# EAGLE design Shield_2_No Ardy (EAGLE 9.2.0)
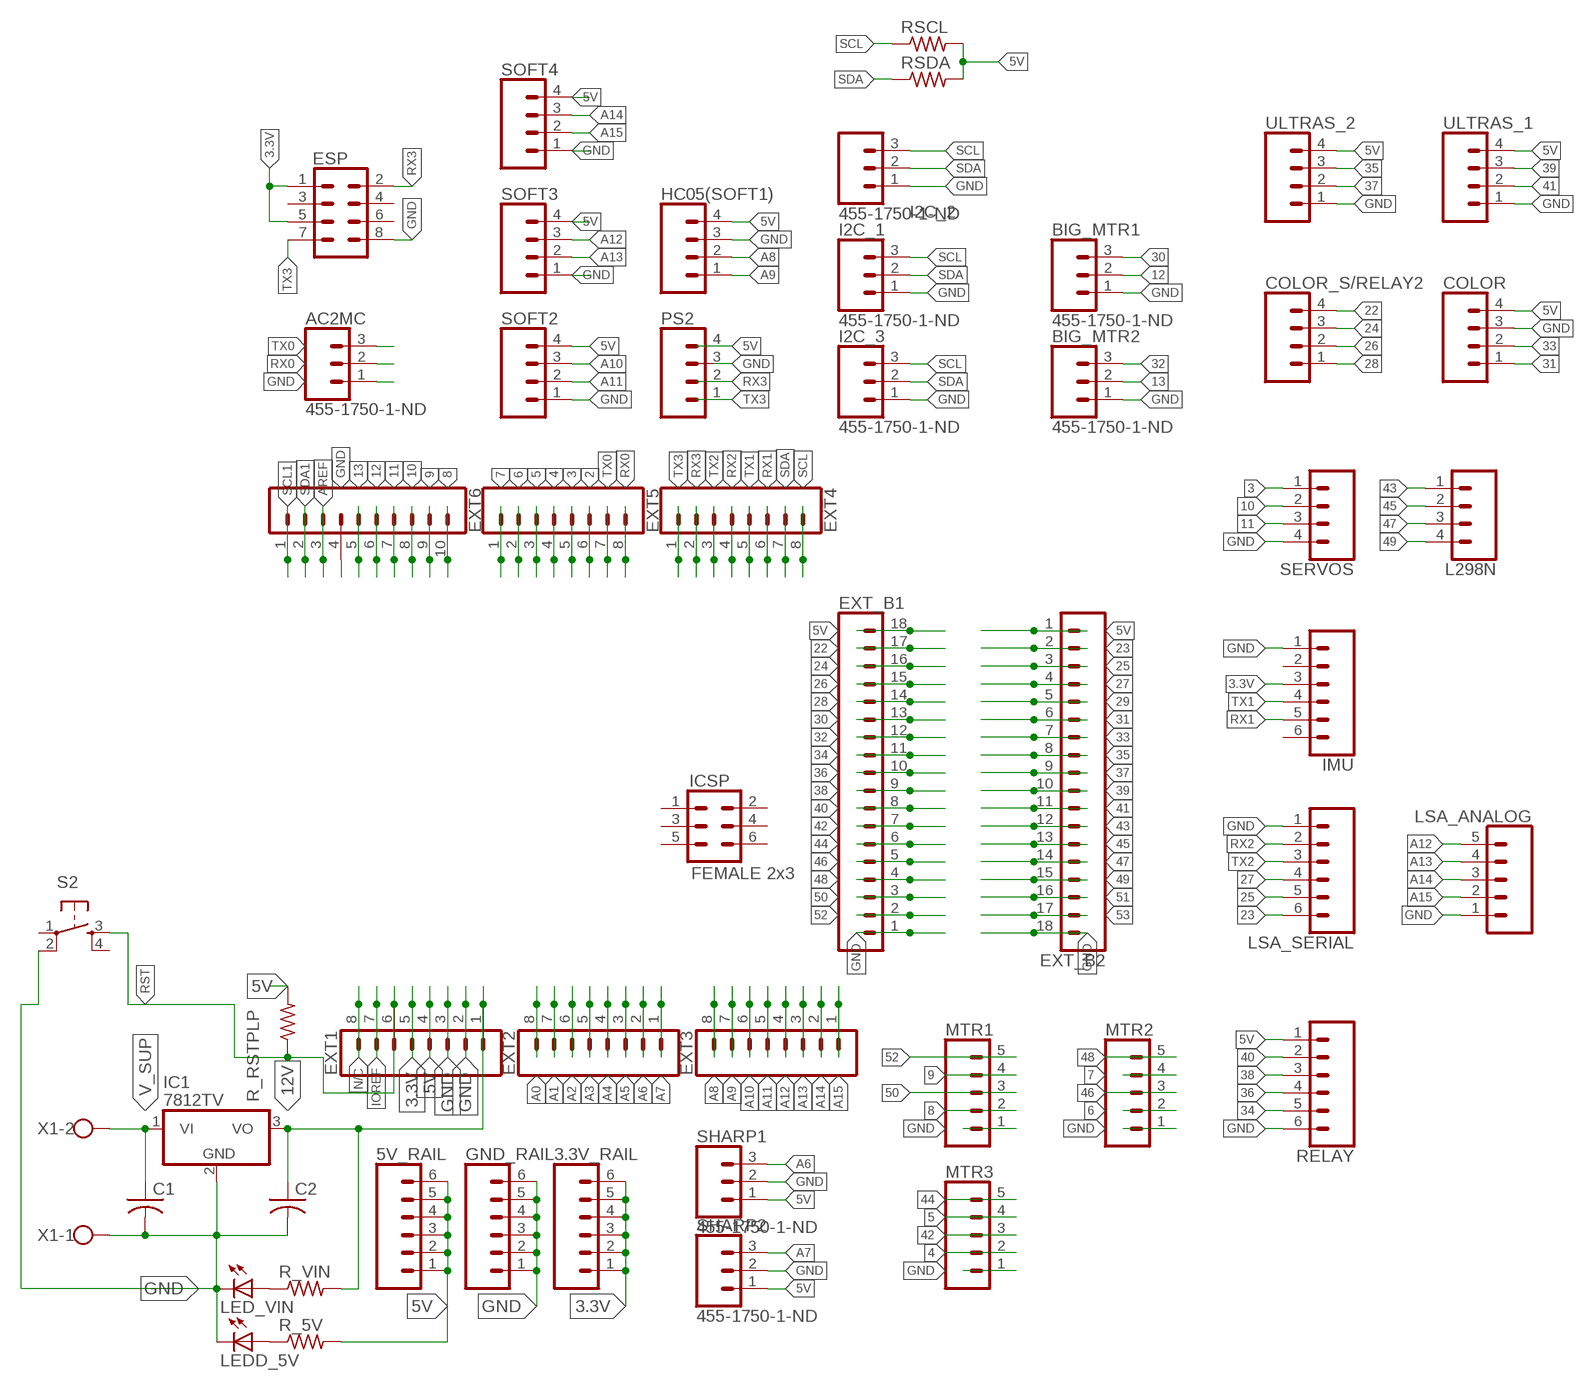
[diagram p0: schematic, sheet 1]

## Parts
3.3V_RAIL  CONN_06SILK_FEMALE_PTH  [1X06]
5V_RAIL  CONN_06SILK_FEMALE_PTH  [1X06]
AC2MC  455-1750-1-ND  CONN_03  [1X03]
BIG_MTR1  455-1750-1-ND  CONN_03  [1X03]
BIG_MTR2  455-1750-1-ND  CONN_03  [1X03]
C1  C-US025-024X044  [C025-024X044]
C2  C-US025-024X044  [C025-024X044]
COLOR  CONN_04  [1X04]
COLOR_S/RELAY2  CONN_04  [1X04]
ESP  CONN_04X2  [2X4]
EXT1  CONN_08"  [1X08]
EXT2  CONN_08"  [1X08]
EXT3  CONN_08"  [1X08]
EXT4  CONN_08"  [1X08]
EXT5  CONN_08"  [1X08]
EXT6  CONN_10"  [1X10]
EXT_B1  CONN_18  [1X18_NO_SILK]
EXT_B2  CONN_18  [1X18_NO_SILK]
GND_RAIL  CONN_06SILK_FEMALE_PTH  [1X06]
HC05(SOFT1)  CONN_04  [1X04]
I2C_1  455-1750-1-ND  CONN_03  [1X03]
I2C_2  455-1750-1-ND  CONN_03  [1X03]
I2C_3  455-1750-1-ND  CONN_03  [1X03]
IC1  7812TV  [TO220V]
ICSP  FEMALE 2x3  CONN_03X2FEMALE  [2X3]
IMU  CONN_06SILK_FEMALE_PTH  [1X06]
L298N  CONN_04  [1X04]
LED_VIN  LED5MM  [LED5MM]
LEDD_5V  LED5MM  [LED5MM]
LSA_ANALOG  CONN_05  [1X05]
LSA_SERIAL  CONN_06SILK_FEMALE_PTH  [1X06]
MTR1  CONN_05  [1X05]
MTR2  CONN_05  [1X05]
MTR3  CONN_05  [1X05]
PS2  CONN_04  [1X04]
R_5V  R-US_0204/7  [0204/7]
R_RSTPLP  R-US_0204/7  [0204/7]
R_VIN  R-US_0204/7  [0204/7]
RELAY  CONN_06SILK_FEMALE_PTH  [1X06]
RSCL  R-US_0204/7  [0204/7]
RSDA  R-US_0204/7  [0204/7]
S2  TAC_SWITCHPTH  [TACTILE-PTH]
SERVOS  CONN_04  [1X04]
SHARP1  455-1750-1-ND  CONN_03  [1X03]
SHARP2  455-1750-1-ND  CONN_03  [1X03]
SOFT2  CONN_04  [1X04]
SOFT3  CONN_04  [1X04]
SOFT4  CONN_04  [1X04]
ULTRAS_1  CONN_04  [1X04]
ULTRAS_2  CONN_04  [1X04]
X1  W237-102  [W237-102]

## Nets
2: EXT5.6
3: EXT5.5 SERVOS.1
3.3V: 3.3V_RAIL.1 3.3V_RAIL.2 3.3V_RAIL.3 3.3V_RAIL.4 3.3V_RAIL.5 3.3V_RAIL.6 ESP.1 ESP.5 EXT1.5 IMU.3
4: EXT5.4 MTR3.2
5: EXT5.3 MTR3.4
5V: 5V_RAIL.1 5V_RAIL.2 5V_RAIL.3 5V_RAIL.4 5V_RAIL.5 5V_RAIL.6 COLOR.4 EXT1.4 EXT_B1.18 EXT_B2.1 HC05(SOFT1).4 PS2.4 R_5V.2 R_RSTPLP.2 RELAY.1 RSCL.2 RSDA.2 SHARP1.1 SHARP2.1 SOFT2.4 SOFT3.4 SOFT4.4 ULTRAS_1.4 ULTRAS_2.4
6: EXT5.2 MTR2.2
7: EXT5.1 MTR2.4
8: EXT6.10 MTR1.2
9: EXT6.9 MTR1.4
10: EXT6.8 SERVOS.2
11: EXT6.7 SERVOS.3
12: BIG_MTR1.2 EXT6.6
12V: C2.1 EXT1.1 IC1.3(VO) R_VIN.2
13: BIG_MTR2.2 EXT6.5
22: COLOR_S/RELAY2.4 EXT_B1.17
23: EXT_B2.2 LSA_SERIAL.6
24: COLOR_S/RELAY2.3 EXT_B1.16
25: EXT_B2.3 LSA_SERIAL.5
26: COLOR_S/RELAY2.2 EXT_B1.15
27: EXT_B2.4 LSA_SERIAL.4
28: COLOR_S/RELAY2.1 EXT_B1.14
29: EXT_B2.5
30: BIG_MTR1.3 EXT_B1.13
31: COLOR.1 EXT_B2.6
32: BIG_MTR2.3 EXT_B1.12
33: COLOR.2 EXT_B2.7
34: EXT_B1.11 RELAY.5
35: EXT_B2.8 ULTRAS_2.3
36: EXT_B1.10 RELAY.4
37: EXT_B2.9 ULTRAS_2.2
38: EXT_B1.9 RELAY.3
39: EXT_B2.10 ULTRAS_1.3
40: EXT_B1.8 RELAY.2
41: EXT_B2.11 ULTRAS_1.2
42: EXT_B1.7 MTR3.3
43: EXT_B2.12 L298N.1
44: EXT_B1.6 MTR3.5
45: EXT_B2.13 L298N.2
46: EXT_B1.5 MTR2.3
47: EXT_B2.14 L298N.3
48: EXT_B1.4 MTR2.5
49: EXT_B2.15 L298N.4
50: EXT_B1.3 MTR1.3
51: EXT_B2.16
52: EXT_B1.2 MTR1.5
53: EXT_B2.17
A0: EXT2.8
A1: EXT2.7
A2: EXT2.6
A3: EXT2.5
A4: EXT2.4
A5: EXT2.3
A6: EXT2.2 SHARP1.3
A7: EXT2.1 SHARP2.3
A8: EXT3.8 HC05(SOFT1).2
A9: EXT3.7 HC05(SOFT1).1
A10: EXT3.6 SOFT2.3
A11: EXT3.5 SOFT2.2
A12: EXT3.4 LSA_ANALOG.5 SOFT3.3
A13: EXT3.3 LSA_ANALOG.4 SOFT3.2
A14: EXT3.2 LSA_ANALOG.3 SOFT4.3
A15: EXT3.1 LSA_ANALOG.2 SOFT4.2
AREF: EXT6.3
GND: AC2MC.1 BIG_MTR1.1 BIG_MTR2.1 C1.2 C2.2 COLOR.3 ESP.8 EXT1.2 EXT1.3 EXT6.4 EXT_B1.1 EXT_B2.18 GND_RAIL.1 GND_RAIL.2 GND_RAIL.3 GND_RAIL.4 GND_RAIL.5 GND_RAIL.6 HC05(SOFT1).3 I2C_1.1 I2C_2.1 I2C_3.1 IC1.2(GND) IMU.1 LED_VIN.K(C) LEDD_5V.K(C) LSA_ANALOG.1 LSA_SERIAL.1 MTR1.1 MTR2.1 MTR3.1 PS2.3 RELAY.6 S2.2 SERVOS.4 SHARP1.2 SHARP2.2 SOFT2.1 SOFT3.1 SOFT4.1 ULTRAS_1.1 ULTRAS_2.1 X1.1
IOREF: EXT1.7
N$4: LED_VIN.A R_VIN.1
N$5: LEDD_5V.A R_5V.1
N/C: EXT1.8
RST: EXT1.6 R_RSTPLP.1 S2.3
RX0: AC2MC.2 EXT5.8
RX1: EXT4.6 IMU.5
RX2: EXT4.4 LSA_SERIAL.2
RX3: ESP.2 EXT4.2 PS2.2
SCL: EXT4.8 I2C_1.3 I2C_2.3 I2C_3.3 RSCL.1
SCL1: EXT6.1
SDA: EXT4.7 I2C_1.2 I2C_2.2 I2C_3.2 RSDA.1
SDA1: EXT6.2
TX0: AC2MC.3 EXT5.7
TX1: EXT4.5 IMU.4
TX2: EXT4.3 LSA_SERIAL.3
TX3: ESP.7 EXT4.1 PS2.1
V_SUP: C1.1 IC1.1(VI) X1.2
Unconnected: ESP.3 ESP.4 ESP.6 ICSP.1 ICSP.2 ICSP.3 ICSP.4 ICSP.5 ICSP.6 IMU.2 IMU.6 S2.1 S2.4

## Library data of the parts
3.3V_RAIL 5V_RAIL GND_RAIL IMU LSA_SERIAL RELAY = SparkFun-Connectors:CONN_06: Multi connection point. Often used as Generic Header-pin footprint for 0.1 inch spaced/style header connections On any of the 0.1 inch spaced packages, you can populate with these: Break Away Headers - Straight <https://www.sparkfun.com/products/116> (PRT-00116) Break Away Male Headers - Right Angle <https://www.sparkfun.com/products/553> (PRT-00553) Female Headers <https://www.sparkfun.com/products/115> (PRT-00115) Break Away Headers - Machine Pin <https://www.sparkfun.com/products/117> (PRT-00117) Break Away Female Headers - Swiss Machine Pin <https://www.sparkfun.com/products/743> (PRT-00743) Arduino Stackable Header - 6 Pin <https://www.sparkfun.com/products/9280> (PRT-09280) For SCREWTERMINALS and SPRING TERMINALS visit here: Screw Terimnals on SparkFun.com <https://www.sparkfun.com/search/results?term=Screw+Terminals> (5mm/3.5mm/2.54mm spacing) This device is also useful as a general connection point to wire up your design to another part of your project. Our various solder wires solder well into these plated through hole pads. Hook-Up Wire - Assortment (Stranded, 22 AWG) <https://www.sparkfun.com/products/11375> (PRT-11375) Hook-Up Wire - Assortment (Solid Core, 22 AWG) <https://www.sparkfun.com/products/11367> (PRT-11367) View the entire wire category on our website here <https://www.sparkfun.com/categories/141>; PROD_ID: CONN-08437
AC2MC BIG_MTR1 BIG_MTR2 I2C_1-I2C_3 SHARP1 SHARP2 = SparkFun-Connectors:CONN_03: Multi connection point. Often used as Generic Header-pin footprint for 0.1 inch spaced/style header connections On any of the 0.1 inch spaced packages, you can populate with these: Break Away Headers - Straight <https://www.sparkfun.com/products/116> (PRT-00116) Break Away Male Headers - Right Angle <https://www.sparkfun.com/products/553> (PRT-00553) Female Headers <https://www.sparkfun.com/products/115> (PRT-00115) Break Away Headers - Machine Pin <https://www.sparkfun.com/products/117> (PRT-00117) Break Away Female Headers - Swiss Machine Pin <https://www.sparkfun.com/products/743> (PRT-00743) Stackable Header - 3 Pin (Female, 0.1") <https://www.sparkfun.com/products/13875> (PRT-13875) For SCREWTERMINALS and SPRING TERMINALS visit here: Screw Terimnals on SparkFun.com <https://www.sparkfun.com/search/results?term=Screw+Terminals> (5mm/3.5mm/2.54mm spacing) This device is also useful as a general connection point to wire up your design to another part of your project. Our various solder wires solder well into these plated through hole pads. Hook-Up Wire - Assortment (Stranded, 22 AWG) <https://www.sparkfun.com/products/11375> (PRT-11375) Hook-Up Wire - Assortment (Solid Core, 22 AWG) <https://www.sparkfun.com/products/11367> (PRT-11367) View the entire wire category on our website here <https://www.sparkfun.com/categories/141> Special notes: Molex polarized connector foot print use with SKU : PRT-08232 with associated crimp pins and housings.; PROD_ID: XXX-00000
C1 C2 = adafruit:C-US: CAPACITOR, American symbol
COLOR COLOR_S/RELAY2 HC05(SOFT1) L298N PS2 SERVOS SOFT2-SOFT4 ULTRAS_1 ULTRAS_2 = SparkFun-Connectors:CONN_04: Multi connection point. Often used as Generic Header-pin footprint for 0.1 inch spaced/style header connections On any of the 0.1 inch spaced packages, you can populate with these: Break Away Headers - Straight <https://www.sparkfun.com/products/116> (PRT-00116) Break Away Male Headers - Right Angle <https://www.sparkfun.com/products/553> (PRT-00553) Female Headers <https://www.sparkfun.com/products/115> (PRT-00115) Break Away Headers - Machine Pin <https://www.sparkfun.com/products/117> (PRT-00117) Break Away Female Headers - Swiss Machine Pin <https://www.sparkfun.com/products/743> (PRT-00743) For SCREWTERMINALS and SPRING TERMINALS visit here: Screw Terimnals on SparkFun.com <https://www.sparkfun.com/search/results?term=Screw+Terminals> (5mm/3.5mm/2.54mm spacing) This device is also useful as a general connection point to wire up your design to another part of your project. Our various solder wires solder well into these plated through hole pads. Hook-Up Wire - Assortment (Stranded, 22 AWG) <https://www.sparkfun.com/products/11375> (PRT-11375) Hook-Up Wire - Assortment (Solid Core, 22 AWG) <https://www.sparkfun.com/products/11367> (PRT-11367) View the entire wire category on our website here <https://www.sparkfun.com/categories/141> Special notes: Molex polarized connector foot print use with SKU : PRT-08231 with associated crimp pins and housings. 1MM SMD Version SKU: PRT-10208; PROD_ID: CONN-09696
ESP = SparkFun-Connectors:CONN_04X2: Multi connection point. Often used as Generic Header-pin footprint for 0.1 inch spaced/style header connections On any of the 0.1 inch spaced packages, you can populate with these: Break Away Headers - Straight <https://www.sparkfun.com/products/116> (PRT-00116) Break Away Male Headers - Right Angle <https://www.sparkfun.com/products/553> (PRT-00553) Female Headers <https://www.sparkfun.com/products/115> (PRT-00115) Break Away Headers - Machine Pin <https://www.sparkfun.com/products/117> (PRT-00117) Break Away Female Headers - Swiss Machine Pin <https://www.sparkfun.com/products/743> (PRT-00743)
EXT1-EXT5 = SparkFun-Connectors:CONN_08: Multi connection point. Often used as Generic Header-pin footprint for 0.1 inch spaced/style header connections On any of the 0.1 inch spaced packages, you can populate with these: Break Away Headers - Straight <https://www.sparkfun.com/products/116> (PRT-00116) Break Away Male Headers - Right Angle <https://www.sparkfun.com/products/553> (PRT-00553) Female Headers <https://www.sparkfun.com/products/115> (PRT-00115) Break Away Headers - Machine Pin <https://www.sparkfun.com/products/117> (PRT-00117) Break Away Female Headers - Swiss Machine Pin <https://www.sparkfun.com/products/743> (PRT-00743) Arduino Stackable Header - 8 Pin <https://www.sparkfun.com/products/9279> (PRT-09279) For SCREWTERMINALS and SPRING TERMINALS visit here: Screw Terimnals on SparkFun.com <https://www.sparkfun.com/search/results?term=Screw+Terminals> (5mm/3.5mm/2.54mm spacing) This device is also useful as a general connection point to wire up your design to another part of your project. Our various solder wires solder well into these plated through hole pads. Hook-Up Wire - Assortment (Stranded, 22 AWG) <https://www.sparkfun.com/products/11375> (PRT-11375) Hook-Up Wire - Assortment (Solid Core, 22 AWG) <https://www.sparkfun.com/products/11367> (PRT-11367) View the entire wire category on our website here <https://www.sparkfun.com/categories/141> Special notes: Molex polarized connector foot print use with SKU : PRT-08231 with associated crimp pins and housings. 1MM SMD Version SKU: PRT-10208 NOTES ON THE VARIANTS LOCK and LOCK_LONGPADS... This footprint was designed to help hold the alignment of a through-hole component (i.e. 6-pin header) while soldering it into place. You may notice that each hole has been shifted either up or down by 0.005 of an inch from it's more standard position (which is a perfectly straight line). This slight alteration caused the pins (the squares in the middle) to touch the edges of the holes. Because they are alternating, it causes a "brace" to hold the component in place. 0.005 has proven to be the perfect amount of "off-center" position when using our standard breakaway headers. Although looks a little odd when you look at the bare footprint, once you have a header in there, the alteration is very hard to notice. Also,if you push a header all the way into place, it is covered up entirely on the bottom side.; PROD_ID: CONN-08438
EXT6 = SparkFun-Connectors:CONN_10: Multi connection point. Often used as Generic Header-pin footprint for 0.1 inch spaced/style header connections On any of the 0.1 inch spaced packages, you can populate with these: Break Away Headers - Straight <https://www.sparkfun.com/products/116> (PRT-00116) Break Away Male Headers - Right Angle <https://www.sparkfun.com/products/553> (PRT-00553) Female Headers <https://www.sparkfun.com/products/115> (PRT-00115) Break Away Headers - Machine Pin <https://www.sparkfun.com/products/117> (PRT-00117) Break Away Female Headers - Swiss Machine Pin <https://www.sparkfun.com/products/743> (PRT-00743) Arduino Stackable Header - 10 Pin <https://www.sparkfun.com/products/11376> (PRT-11376) For SCREWTERMINALS and SPRING TERMINALS visit here: Screw Terimnals on SparkFun.com <https://www.sparkfun.com/search/results?term=Screw+Terminals> (5mm/3.5mm/2.54mm spacing) This device is also useful as a general connection point to wire up your design to another part of your project. Our various solder wires solder well into these plated through hole pads. Hook-Up Wire - Assortment (Stranded, 22 AWG) <https://www.sparkfun.com/products/11375> (PRT-11375) Hook-Up Wire - Assortment (Solid Core, 22 AWG) <https://www.sparkfun.com/products/11367> (PRT-11367) View the entire wire category on our website here <https://www.sparkfun.com/categories/141> Special notes: Molex polarized connector foot print use with SKU : PRT-08231 with associated crimp pins and housings. 1MM SMD Version SKU: PRT-10208 NOTES ON THE VARIANTS LOCK and LOCK_LONGPADS... This footprint was designed to help hold the alignment of a through-hole component (i.e. 6-pin header) while soldering it into place. You may notice that each hole has been shifted either up or down by 0.005 of an inch from it's more standard position (which is a perfectly straight line). This slight alteration caused the pins (the squares in the middle) to touch the edges of the holes. Because they are alternating, it causes a "brace" to hold the component in place. 0.005 has proven to be the perfect amount of "off-center" position when using our standard breakaway headers. Although looks a little odd when you look at the bare footprint, once you have a header in there, the alteration is very hard to notice. Also,if you push a header all the way into place, it is covered up entirely on the bottom side.; PROD_ID: CONN-11563
EXT_B1 EXT_B2 = SparkFun-Connectors:CONN_18: Multi connection point. Often used as Generic Header-pin footprint for 0.1 inch spaced/style header connections On any of the 0.1 inch spaced packages, you can populate with these: Break Away Headers - Straight <https://www.sparkfun.com/products/116> (PRT-00116) Break Away Male Headers - Right Angle <https://www.sparkfun.com/products/553> (PRT-00553) Female Headers <https://www.sparkfun.com/products/115> (PRT-00115) Break Away Headers - Machine Pin <https://www.sparkfun.com/products/117> (PRT-00117) Break Away Female Headers - Swiss Machine Pin <https://www.sparkfun.com/products/743> (PRT-00743) For SCREWTERMINALS and SPRING TERMINALS visit here: Screw Terimnals on SparkFun.com <https://www.sparkfun.com/search/results?term=Screw+Terminals> (5mm/3.5mm/2.54mm spacing) This device is also useful as a general connection point to wire up your design to another part of your project. Our various solder wires solder well into these plated through hole pads. Hook-Up Wire - Assortment (Stranded, 22 AWG) <https://www.sparkfun.com/products/11375> (PRT-11375) Hook-Up Wire - Assortment (Solid Core, 22 AWG) <https://www.sparkfun.com/products/11367> (PRT-11367) View the entire wire category on our website here <https://www.sparkfun.com/categories/141> Special notes: Molex polarized connector foot print use with SKU : PRT-08231 with associated crimp pins and housings. 1MM SMD Version SKU: PRT-10208 NOTES ON THE VARIANTS LOCK and LOCK_LONGPADS... This footprint was designed to help hold the alignment of a through-hole component (i.e. 6-pin header) while soldering it into place. You may notice that each hole has been shifted either up or down by 0.005 of an inch from it's more standard position (which is a perfectly straight line). This slight alteration caused the pins (the squares in the middle) to touch the edges of the holes. Because they are alternating, it causes a "brace" to hold the component in place. 0.005 has proven to be the perfect amount of "off-center" position when using our standard breakaway headers. Although looks a little odd when you look at the bare footprint, once you have a header in there, the alteration is very hard to notice. Also,if you push a header all the way into place, it is covered up entirely on the bottom side.
IC1 = linear:78*: Positive VOLTAGE REGULATOR Source: http://cache.national.com/ds/LM/LM78L05.pdf http://www.fairchildsemi.com/ds/LM/LM7805.pdf
ICSP = SparkFun-Connectors:CONN_03X2: Multi connection point. Often used as Generic Header-pin footprint for 0.1 inch spaced/style header connections You can populate with any combo of single row headers, but if you'd like an exact match, check these: Header - 2x3 (Male, 0.1") <https://www.sparkfun.com/products/12807> (PRT-12807) Header - 2x3 (Female, 0.1") <https://www.sparkfun.com/products/13010> (PRT-13010) 2x3 Pin Shrouded Header <https://www.sparkfun.com/products/10877> (PRT-10877) On any of the 0.1 inch spaced packages, you can populate with these: Break Away Headers - Straight <https://www.sparkfun.com/products/116> (PRT-00116) Break Away Male Headers - Right Angle <https://www.sparkfun.com/products/553> (PRT-00553) Female Headers <https://www.sparkfun.com/products/115> (PRT-00115) Break Away Headers - Machine Pin <https://www.sparkfun.com/products/117> (PRT-00117) Break Away Female Headers - Swiss Machine Pin <https://www.sparkfun.com/products/743> (PRT-00743) Special note: the shrouded connector mates well with our 3x2 ribbon cables: Ribbon Crimp Connector - 6-pin (2x3, Female) <https://www.sparkfun.com/products/10651> (PRT-10651) Ribbon Cable - 6 wire (15ft) <https://www.sparkfun.com/products/10646> (PRT-10646); PROD_ID: CONN-11566
LED_VIN LEDD_5V = adafruit:LED: LED OSRAM: - CHIPLED LG R971, LG N971, LY N971, LG Q971, LY Q971, LO R971, LY R971 LH N974, LH R974 LS Q976, LO Q976, LY Q976 LO Q996 - Hyper CHIPLED LW Q18S LB Q993, LB Q99A, LB R99A - SideLED LS A670, LO A670, LY A670, LG A670, LP A670 LB A673, LV A673, LT A673, LW A673 LH A674 LY A675 LS A676, LA A676, LO A676, LY A676, LW A676 LS A679, LY A679, LG A679 - Hyper Micro SIDELED® LS Y876, LA Y876, LO Y876, LY Y876 LT Y87S - SmartLED LW L88C, LW L88S LB L89C, LB L89S, LG L890 LS L89K, LO L89K, LY L89K LS L896, LA L896, LO L896, LY L896 - TOPLED LS T670, LO T670, LY T670, LG T670, LP T670 LSG T670, LSP T670, LSY T670, LOP T670, LYG T670 LG T671, LOG T671, LSG T671 LB T673, LV T673, LT T673, LW T673 LH T674 LS T676, LA T676, LO T676, LY T676, LB T676, LH T676, LSB T676, LW T676 LB T67C, LV T67C, LT T67C, LS T67K, LO T67K, LY T67K, LW E67C LS E67B, LA E67B, LO E67B, LY E67B, LB E67C, LV E67C, LT E67C LW T67C LS T679, LY T679, LG T679 LS T770, LO T770, LY T770, LG T770, LP T770 LB T773, LV T773, LT T773, LW T773 LH T774 LS E675, LA E675, LY E675, LS T675 LS T776, LA T776, LO T776, LY T776, LB T776 LHGB T686 LT T68C, LB T68C - Hyper Mini TOPLED® LB M676 - Mini TOPLED Santana® LG M470 LS M47K, LO M47K, LY M47K Source: http://www.osram.convergy.de/
LSA_ANALOG MTR1-MTR3 = SparkFun-Connectors:CONN_05: Multi connection point. Often used as Generic Header-pin footprint for 0.1 inch spaced/style header connections On any of the 0.1 inch spaced packages, you can populate with these: Break Away Headers - Straight <https://www.sparkfun.com/products/116> (PRT-00116) Break Away Male Headers - Right Angle <https://www.sparkfun.com/products/553> (PRT-00553) Female Headers <https://www.sparkfun.com/products/115> (PRT-00115) Break Away Headers - Machine Pin <https://www.sparkfun.com/products/117> (PRT-00117) Break Away Female Headers - Swiss Machine Pin <https://www.sparkfun.com/products/743> (PRT-00743) For SCREWTERMINALS and SPRING TERMINALS visit here: Screw Terimnals on SparkFun.com <https://www.sparkfun.com/search/results?term=Screw+Terminals> (5mm/3.5mm/2.54mm spacing) This device is also useful as a general connection point to wire up your design to another part of your project. Our various solder wires solder well into these plated through hole pads. Hook-Up Wire - Assortment (Stranded, 22 AWG) <https://www.sparkfun.com/products/11375> (PRT-11375) Hook-Up Wire - Assortment (Solid Core, 22 AWG) <https://www.sparkfun.com/products/11367> (PRT-11367) View the entire wire category on our website here <https://www.sparkfun.com/categories/141> Special notes: Molex polarized connector foot print use with SKU : PRT-08231 with associated crimp pins and housings. 1MM SMD Version SKU: PRT-10208
R_5V R_RSTPLP R_VIN RSCL RSDA = adafruit:R-US_: RESISTOR, American symbol
S2 = SparkFun-Retired:TAC_SWITCH: Momentary Switch Button commonly used for reset or general input. Spark Fun Electronics SKU : COM-00097 SMT- SWCH-08247
X1 = con-wago-500:W237-102: WAGO SCREW CLAMP; MPN: 237-102; OC_FARNELL: unknown; OC_NEWARK: 70K9898

## Board
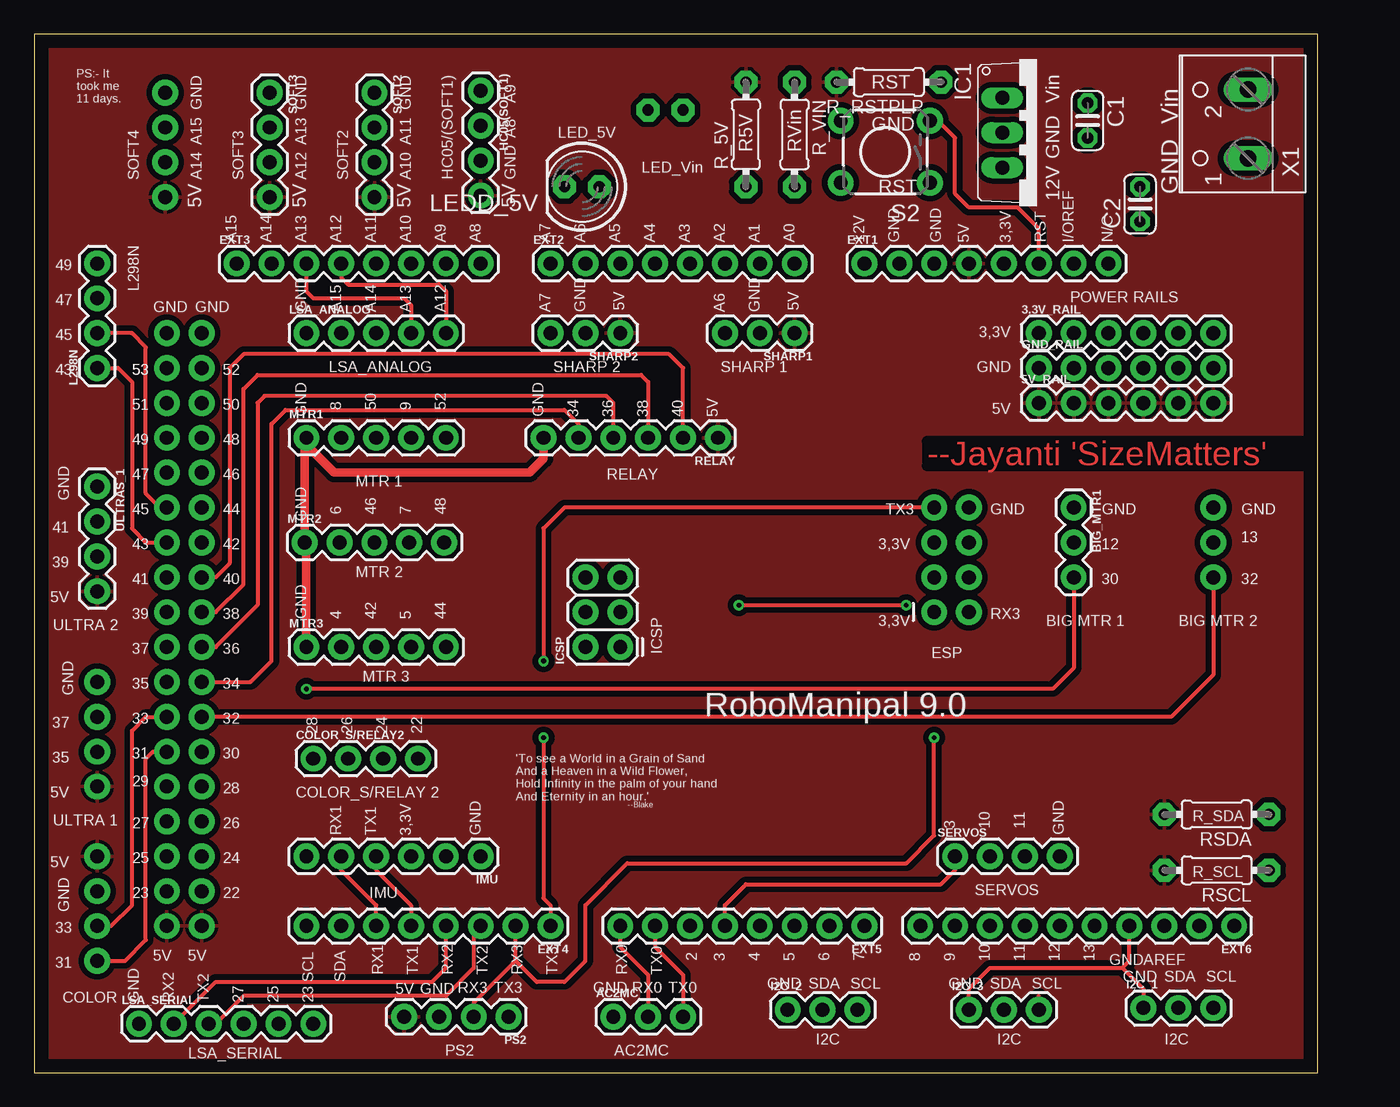
[diagram p1: board, top side]
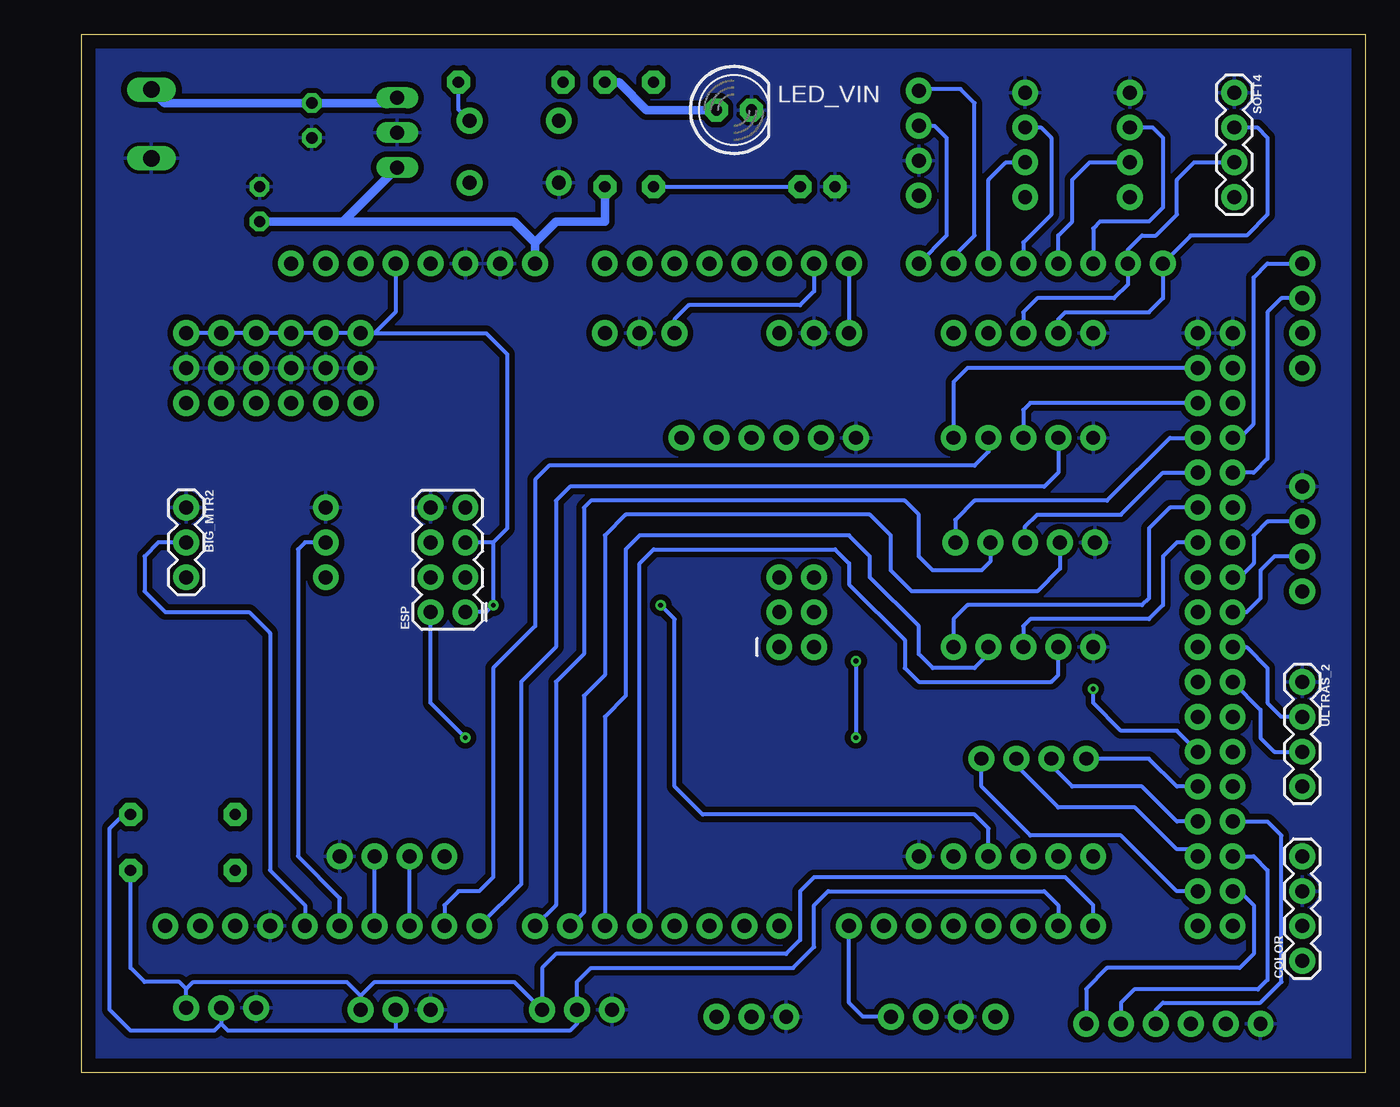
[diagram p2: board, bottom side, seen from below]

Size 93.45 x 75.62 mm. Coordinates in mm from the lower left corner, seen from the top.
Outline: 0,0 93.45,0 93.45,75.62 0,75.62 0,0
Copper layers (1*16): Top 0.035mm / dielectric 1.5mm / Bottom 0.035mm
Design rules "default": minimum track width 6mil, minimum drill 0.35mm, track to track 6mil, track to pad 6mil, pad to pad 6mil, via to via 6mil, smd to smd 6mil, copper to edge 40mil, drill to drill 6mil, minimum pad ring 10mil, minimum via ring 8mil, stop-mask expansion 4mil, vias tented up to drill 0mil, thermal gap 10mil

### Footprints (pad centres in the part's own frame; a part is rotated, then mirrored left to right if it is on the bottom)
1X06 = drill 1.016 pad 1.88: 1 0,0; 2 2.54,0; 3 5.08,0; 4 7.62,0; 5 10.16,0; 6 12.7,0
1X03 = drill 1.016 pad 1.88: 1 0,0; 2 2.54,0; 3 5.08,0
C025-024X044 = drill 0.813 pad 1.422 octagon: 1 -1.27,0; 2 1.27,0
1X04 = drill 1.016 pad 1.88: 1 0,0; 2 2.54,0; 3 5.08,0; 4 7.62,0
2X4 = drill 1.016 pad 1.88: 1 -3.81,-1.27; 2 -3.81,1.27; 3 -1.27,-1.27; 4 -1.27,1.27; 5 1.27,-1.27; 6 1.27,1.27; 7 3.81,-1.27; 8 3.81,1.27
1X08 = drill 1.016 pad 1.88: 1 0,0; 2 2.54,0; 3 5.08,0; 4 7.62,0; 5 10.16,0; 6 12.7,0; 7 15.24,0; 8 17.78,0
1X10 = drill 1.016 pad 1.88: 1 0,0; 2 2.54,0; 3 5.08,0; 4 7.62,0; 5 10.16,0; 6 12.7,0; 7 15.24,0; 8 17.78,0; 9 20.32,0; 10 22.86,0
1X18_NO_SILK = drill 1.016 pad 1.88: 1 0,0; 2 2.54,0; 3 5.08,0; 4 7.62,0; 5 10.16,0; 6 12.7,0; 7 15.24,0; 8 17.78,0; 9 20.32,0; 10 22.86,0; 11 25.4,0; 12 27.94,0; 13 30.48,0; 14 33.02,0; 15 35.56,0; 16 38.1,0; 17 40.64,0; 18 43.18,0
TO220V = drill 1.016 long: 1 -2.54,-2.54; 2 0,-2.54; 3 2.54,-2.54
2X3 = drill 1.016 pad 1.88: 1 0,0; 2 0,2.54; 3 2.54,0; 4 2.54,2.54; 5 5.08,0; 6 5.08,2.54
LED5MM = drill 0.813 pad 1.676 octagon: A -1.27,0; K 1.27,0
1X05 = drill 1.016 pad 1.88: 1 0,0; 2 2.54,0; 3 5.08,0; 4 7.62,0; 5 10.16,0
0204/7 = drill 0.813 pad 1.676 octagon: 1 -3.81,0; 2 3.81,0
TACTILE-PTH = drill 1.016 pad 1.88: 1 -3.251,2.261; 2 3.251,2.261; 3 -3.251,-2.261; 4 3.251,-2.261
W237-102 = drill 1.194 long: 1 -2.5,-1.27; 2 2.5,-1.27

### Placement (x,y rotation side)
3.3V_RAIL  73.15,53.85 0 top
5V_RAIL  73.15,48.77 0 top
AC2MC  42.16,4.06 0 top
BIG_MTR1  75.69,41.15 270 top
BIG_MTR2  85.85,41.15 270 bottom
C1  76.71,69.34 270 top
C2  80.52,63.25 90 top
COLOR  4.57,8.13 90 bottom
COLOR_S/RELAY2  20.32,22.86 0 top
ESP  66.8,37.34 90 bottom
EXT1  60.45,58.93 0 top
EXT2  37.59,58.93 0 top
EXT3  14.73,58.93 0 top
EXT4  37.59,10.67 180 top
EXT5  60.45,10.67 180 top
EXT6  87.38,10.67 180 top
EXT_B1  12.19,53.85 270 bottom
EXT_B2  9.65,10.67 90 top
GND_RAIL  73.15,51.31 0 top
HC05(SOFT1)  32.51,71.5 270 top
I2C_1  80.77,4.7 0 top
I2C_2  54.86,4.57 0 top
I2C_3  68.07,4.57 0 top
IC1  73.03,68.45 270 top
ICSP  42.67,30.99 90 top
IMU  32.51,15.75 180 top
L298N  4.57,51.31 90 top
LED_VIN  45.97,70.1 0 bottom
LEDD_5V  39.88,64.52 180 top
LSA_ANALOG  19.81,53.85 0 top
LSA_SERIAL  7.62,3.56 0 top
MTR1  19.81,46.23 0 top
MTR2  19.69,38.61 0 top
MTR3  19.81,30.99 0 top
PS2  34.54,4.06 180 top
R_5V  51.82,68.33 90 top
R_RSTPLP  62.23,72.14 180 top
R_VIN  55.37,68.33 270 top
RELAY  49.78,46.23 180 top
RSCL  86.11,14.73 180 top
RSDA  86.11,18.8 180 top
S2  61.98,67.06 180 top
SERVOS  67.06,15.75 0 top
SHARP1  55.37,53.85 180 top
SHARP2  42.67,53.85 180 top
SOFT2  24.77,71.37 270 top
SOFT3  17.14,71.37 270 top
SOFT4  9.52,71.37 270 bottom
ULTRAS_1  4.57,42.67 270 top
ULTRAS_2  4.57,28.45 270 bottom
X1  87.12,69.09 90 top

### Tracks (layer width: path | path; a pad name or v marks a point on that pad's centre or on a via)
3
  Top 0.305: EXT5.5 50.29,12.19 51.82,13.72 66.04,13.72 67.06,14.73 SERVOS.1
3.3V  (via drill 0.35)
  Top 0.305: v51.31,34.04 v63.5,34.04
  Bottom 0.305: 3.3V_RAIL.1 3.3V_RAIL.2 3.3V_RAIL.3 3.3V_RAIL.4 3.3V_RAIL.5 3.3V_RAIL.6 | EXT1.5 70.61,55.37 72.14,53.85 3.3V_RAIL.1 | 3.3V_RAIL.1 64.01,53.85 62.48,52.32 62.48,39.62 63.5,38.61 | 63.5,38.61 ESP.5 | 63.5,38.61 v63.5,34.04 64.01,33.53 ESP.1 | IMU.3 27.43,17.78 28.45,18.8 48.26,18.8 50.29,20.83 50.29,33.02 v51.31,34.04
4
  Bottom 0.305: EXT5.4 52.83,37.08 51.82,38.1 38.61,38.1 37.59,37.08 37.59,35.56 33.53,31.5 33.53,29.46 32.51,28.45 22.86,28.45 22.35,28.96 MTR3.2
5
  Bottom 0.305: MTR3.4 27.43,30.48 28.45,29.46 31.5,29.46 32.51,30.48 32.51,32.51 36.07,36.07 36.07,37.59 37.59,39.12 52.83,39.12 53.85,38.1 53.85,27.43 55.37,25.91 EXT5.3
5V
  pour Top (isolate 0.406): -3.05,79.25 96.01,79.25 96.01,-2.03 -3.05,-2.03
6
  Bottom 0.305: MTR2.2 22.23,36.7 23.88,35.05 33.02,35.05 34.54,36.58 34.54,39.12 36.07,40.64 53.85,40.64 55.37,39.12 55.37,28.96 56.9,27.43 56.9,11.68 EXT5.2
7
  Bottom 0.305: MTR2.4 27.3,37.21 27.94,36.58 31.5,36.58 32.51,37.59 32.51,40.64 33.53,41.66 56.39,41.66 56.9,41.15 56.9,30.48 58.93,28.45 58.93,12.19 EXT5.1
8
  Bottom 0.305: MTR1.2 22.35,43.69 23.37,42.67 57.91,42.67 58.93,41.66 58.93,30.99 61.47,28.45 61.47,13.72 EXT6.10
9
  Bottom 0.305: MTR1.4 27.43,45.21 28.45,44.2 59.44,44.2 60.45,43.18 60.45,32.51 63.5,29.46 63.5,14.22 64.52,13.21 66.04,13.21 67.06,12.19 EXT6.9
10
  Bottom 0.305: EXT6.8 SERVOS.2
11
  Bottom 0.305: EXT6.7 SERVOS.3
12
  Bottom 0.305: EXT6.6 74.68,12.7 77.72,15.75 77.72,38.1 77.22,38.61 BIG_MTR1.2
12V
  Bottom 0.61: 70.48,65.66 IC1.3 74.42,61.98 | EXT1.1 60.45,60.45 | 60.45,60.45 61.98,61.98 74.42,61.98 | 60.45,60.45 58.93,61.98 55.37,61.98 R_VIN.2 | 74.42,61.98 C2.1
13
  Bottom 0.305: BIG_MTR2.2 87.88,38.61 88.9,37.59 88.9,35.05 87.38,33.53 81.28,33.53 79.76,32 79.76,14.73 77.22,12.19 EXT6.5
22
  Bottom 0.305: EXT_B1.17 13.72,13.21 17.78,17.27 24.38,17.27 27.94,20.83 COLOR_S/RELAY2.4
23
  Bottom 0.305: EXT_B2.2 9.14,13.21 8.13,12.19 8.13,8.64 9.14,7.62 18.8,7.62 20.32,6.1 LSA_SERIAL.6
24
  Bottom 0.305: COLOR_S/RELAY2.3 25.4,22.35 22.35,19.3 16.76,19.3 13.72,16.26 12.7,16.26 EXT_B1.16
25
  Bottom 0.305: EXT_B2.3 8.13,15.75 7.11,14.73 7.11,6.74 7.81,6.04 16.82,6.04 17.78,5.08 LSA_SERIAL.5
26
  Bottom 0.305: EXT_B1.15 13.72,18.29 16.26,20.83 21.34,20.83 22.86,22.35 COLOR_S/RELAY2.2
27
  Bottom 0.305: EXT_B2.4 7.11,18.29 6.1,17.27 6.1,6.6 7.62,5.08 14.73,5.08 15.24,4.57 LSA_SERIAL.4
28
  Bottom 0.305: EXT_B1.14 13.72,20.83 15.75,22.86 COLOR_S/RELAY2.1
30  (via drill 0.35)
  Top 0.305: BIG_MTR1.3 75.69,29.46 74.17,27.94 v19.81,27.94
  Bottom 0.305: EXT_B1.13 13.72,24.89 17.78,24.89 19.81,26.92 v19.81,27.94
31
  Top 0.305: COLOR.1 6.6,8.13 8.13,9.65 8.13,22.86 8.64,23.37 EXT_B2.6
32
  Top 0.305: BIG_MTR2.3 85.85,28.96 82.8,25.91 EXT_B1.12 11.68,25.91
33
  Top 0.305: COLOR.2 5.59,10.67 7.11,12.19 7.11,24.89 8.13,25.91 EXT_B2.7
34
  Top 0.305: RELAY.5 39.62,47.24 38.61,48.26 18.29,48.26 17.27,47.24 17.27,29.97 15.75,28.45 EXT_B1.11
35
  Bottom 0.305: EXT_B2.8 7.62,26.42 7.62,24.38 6.6,23.37 ULTRAS_2.3
36
  Top 0.305: RELAY.4 42.16,48.77 41.66,49.28 16.76,49.28 16.26,48.77 16.26,34.04 13.21,30.99 EXT_B1.10
37
  Bottom 0.305: ULTRAS_2.2 6.1,25.91 7.11,26.92 7.11,29.46 8.64,30.99 EXT_B2.9
38
  Top 0.305: RELAY.3 44.7,50.29 44.2,50.8 16.26,50.8 15.24,49.78 15.24,35.56 13.21,33.53 EXT_B1.9
39
  Bottom 0.305: ULTRAS_1.3 6.6,37.59 7.62,36.58 7.62,34.54 8.64,33.53 EXT_B2.10
40
  Top 0.305: RELAY.2 47.24,51.31 46.23,52.32 15.24,52.32 14.22,51.31 14.22,37.08 13.21,36.07 EXT_B1.8
41
  Bottom 0.305: ULTRAS_1.2 7.11,40.13 8.13,39.12 8.13,37.08 9.14,36.07 EXT_B2.11
42
  Bottom 0.305: EXT_B1.7 13.72,38.61 14.73,37.59 14.73,34.04 15.75,33.02 24.38,33.02 24.89,32.51 MTR3.3
43
  Top 0.305: L298N.1 6.1,51.31 7.11,50.29 7.11,39.62 8.13,38.61 EXT_B2.12
44
  Bottom 0.305: EXT_B1.6 14.22,41.15 15.75,39.62 15.75,34.54 16.26,34.04 28.96,34.04 29.97,33.02 MTR3.5
45
  Top 0.305: EXT_B2.13 9.14,41.15 8.13,42.16 8.13,52.83 7.11,53.85 L298N.2
46
  Bottom 0.305: MTR2.3 24.77,39.75 23.88,40.64 17.78,40.64 14.73,43.69 EXT_B1.5
47
  Bottom 0.305: L298N.3 6.1,56.39 7.11,55.37 7.11,44.7 8.13,43.69 EXT_B2.14
48
  Bottom 0.305: EXT_B1.4 14.22,46.23 18.8,41.66 28.45,41.66 29.85,40.26 MTR2.5
49
  Bottom 0.305: EXT_B2.15 9.14,46.23 8.13,47.24 8.13,57.91 7.11,58.93 L298N.4
50
  Bottom 0.305: EXT_B1.3 24.38,48.77 24.89,48.26 MTR1.3
52
  Bottom 0.305: EXT_B1.2 28.96,51.31 29.97,50.29 MTR1.5
A6
  Bottom 0.305: EXT2.2 40.13,56.9 41.15,55.88 49.28,55.88 50.29,54.86 SHARP1.3
A7
  Bottom 0.305: EXT2.1 SHARP2.3
A8
  Bottom 0.305: HC05(SOFT1).2 31.37,68.96 30.48,68.07 30.48,60.96 EXT3.8
A9
  Bottom 0.305: EXT3.7 29.97,59.44 28.45,60.96 28.45,70.61 29.46,71.63 32.64,71.63 | 33.02,71.63 32.64,71.63 | 32.64,71.63 HC05(SOFT1).1
A10
  Bottom 0.305: EXT3.6 27.43,65.02 26.16,66.29 SOFT2.3
A11
  Bottom 0.305: SOFT2.2 23.62,68.83 22.86,68.07 22.86,62.48 24.89,60.45 EXT3.5
A12
  Top 0.305: EXT3.4 22.35,57.91 22.86,57.4 29.46,57.4 29.97,56.9 LSA_ANALOG.5
  Bottom 0.305: SOFT3.3 20.07,66.29 21.34,65.02 21.34,61.98 22.35,60.96 EXT3.4
A13
  Top 0.305: EXT3.3 19.81,56.9 20.32,56.39 26.92,56.39 27.43,55.88 LSA_ANALOG.4
  Bottom 0.305: SOFT3.2 15.49,68.83 14.73,68.07 14.73,62.99 15.75,61.98 19.3,61.98 19.81,61.47 EXT3.3 19.81,58.42
A14
  Bottom 0.305: SOFT4.3 12.45,66.29 13.72,65.02 13.72,62.48 15.24,60.96 16.26,60.96 17.27,59.94 EXT3.2 17.27,57.4 18.29,56.39 23.88,56.39 24.89,55.37 LSA_ANALOG.3
A15
  Bottom 0.305: SOFT4.2 7.87,68.83 7.11,68.07 7.11,62.48 8.64,60.96 12.7,60.96 EXT3.1 14.73,56.39 15.75,55.37 21.84,55.37 22.35,54.86 LSA_ANALOG.2
GND
  Top 0.305: I2C_3.1 68.07,6.1 69.6,7.62 79.25,7.62 | 79.25,7.62 80.77,6.1 I2C_1.1 | 79.25,7.62 79.76,8.13 EXT6.4
  Top 0.61: MTR3.1 19.81,38.48 MTR2.1 19.69,46.1 MTR1.1 19.81,45.72 21.84,43.69 36.07,43.69 37.08,44.7 RELAY.6
  pour Bottom (isolate 0.406): -5.59,81.79 98.55,81.79 98.55,-4.57 -5.59,-4.57
N$4
  Bottom 0.61: LED_VIN.A 52.32,70.1 54.36,72.14 R_VIN.1
N$5
  Bottom 0.305: R_5V.1 LEDD_5V.A
RST
  Top 0.305: EXT1.6 73.15,61.47 71.63,62.99 68.07,62.99 67.06,64.01 67.06,68.07 65.81,69.32 S2.3
  Bottom 0.305: S2.3 66.04,70.13 R_RSTPLP.1
RX0
  Top 0.305: EXT5.8 42.67,9.14 44.7,7.11 AC2MC.2
RX1
  Top 0.305: EXT4.6 24.89,12.19 22.35,14.73 IMU.5
RX2
  Top 0.305: LSA_SERIAL.2 13.21,6.6 28.96,6.6 29.97,7.62 EXT4.4
RX3  (via drill 0.35)
  Top 0.305: v65.53,24.38 65.53,17.27 63.5,15.24 43.18,15.24 40.13,12.19 40.13,8.13 38.61,6.6 36.58,6.6 35.05,8.13 | 35.05,8.13 EXT4.2 | 35.05,8.13 32,5.08 PS2.2
  Bottom 0.305: v65.53,24.38 68.07,26.92 ESP.2
SCL
  Top 0.305: I2C_3.3 73.15,5.59
  Bottom 0.305: EXT4.8 19.81,12.19 21.84,14.22 40.13,14.22 41.15,13.21 41.15,9.65 42.16,8.64 58.93,8.64 59.94,7.62 I2C_2.3 61.98,6.6 72.14,6.6 73.15,5.59 | I2C_3.3 73.15,5.59 | 73.15,5.59 74.17,6.6 85.34,6.6 85.85,6.1 | I2C_1.3 85.85,6.1 | 85.85,6.1 86.36,6.6 88.9,6.6 89.92,7.62 RSCL.1
SDA
  Bottom 0.305: EXT4.7 22.35,12.19 23.37,13.21 39.12,13.21 40.13,12.19 40.13,9.14 41.66,7.62 56.39,7.62 57.4,6.6 I2C_2.2 57.4,3.56 57.91,3.05 70.61,3.05 | I2C_3.2 70.61,3.05 | 70.61,3.05 82.8,3.05 83.31,3.56 | I2C_1.2 83.31,3.56 | 83.31,3.56 83.82,3.05 89.92,3.05 91.44,4.57 91.44,17.78 90.42,18.8 RSDA.1
TX0
  Top 0.305: EXT5.7 45.21,9.14 47.24,7.11 AC2MC.3
TX1
  Top 0.305: IMU.4 24.89,14.73 27.43,12.19 EXT4.5
TX2
  Top 0.305: LSA_SERIAL.3 13.21,3.56 15.24,5.59 29.97,5.59 32,7.62 32,10.16 EXT4.3
TX3  (via drill 0.35)
  Top 0.305: ESP.7 38.61,41.15 37.08,39.62 v37.08,29.97 | v37.08,24.38 37.08,12.7 37.59,12.19 EXT4.1
  Bottom 0.305: PS2.1 36.58,4.06 37.59,5.08 EXT4.1 | v37.08,29.97 v37.08,24.38
V_SUP
  Bottom 0.61: X1.2 87.42,70.61 C1.1 70.87,70.61 IC1.1

### Text on the board
Top: --Jayanti 'SizeMatters'
tPlace: RST | PS:- It / took me / 11 days. | GND | GND | GND | A9 | Vin | Vin | A8 | LED_5V | GND | A15 | A13 | A11 | R5V | RVin | GND | SOFT4 | A14 | SOFT3 | A12 | SOFT2 | A10 | HC05/(SOFT1) | GND | LED_Vin | RST | GND | 12V | 5V | 5V | 5V | 5V | A15 | A14 | A13 | A12 | A11 | A10 | A9 | A8 | A7 | A6 | A5 | A4 | A3 | A2 | A1 | A0 | 12V | GND | GND | 5V | 3,3V | RST | I/OREF | N/C | 49 | L298N | 5V | 5V | POWER RAILS | 47 | GND | GND | GND | A15 | A14 | A13 | A12 | A7 | GND | A6 | GND | 3,3V | 45 | LSA_ANALOG | SHARP 2 | SHARP 1 | GND | 43 | 53 | 53 | 52 | 51 | 50 | 8 | 50 | 9 | 52 | 5V | GND | GND | 34 | 36 | 38 | 40 | 5V | 49 | 48 | 47 | 46 | RELAY | MTR 1 | GND | 41 | 45 | 44 | GND | 6 | 46 | 7 | 48 | TX3 | GND | GND | GND | 43 | 42 | 3,3V | 12 | 13 | 39 | MTR 2 | 5V | 41 | 40 | 30 | 32 | ULTRA 2 | 39 | 38 | GND | 4 | 42 | 5 | 44 | RX3 | 3,3V | BIG MTR 1 | BIG MTR 2 | 37 | 36 | ICSP | ESP | GND | MTR 3 | 35 | 34 | 37 | 33 | 32 | 28 | 26 | 24 | 22 | RoboManipal 9.0 | 35 | 31 | 30 | 5V | 29 | 28 | COLOR_S/RELAY 2 | 'To see a World in a Grain of Sand / And a Heaven in a Wild Flower, / Hold Infinity in the palm of your hand / And Eternity in an hour.' | --Blake | GND | ULTRA 1 | R_SDA | 27 | 26 | RX1 | TX1 | 3,3V | GND | 3 | 10 | 11 | 5V | 25 | 24 | R_SCL | SERVOS | 23 | 22 | IMU | GND | 33 | 5V | 5V | 2 | 3 | 4 | 5 | 6 | 7 | 8 | 9 | 10 | 11 | 12 | 13 | GND | AREF | 31 | RX1 | TX1 | RX2 | TX2 | RX3 | TX3 | RX0 | TX0 | SCL | SDA | RX3 | TX3 | GND | RX0 | TX0 | GND | SDA | SCL | GND | SDA | SCL | GND | SDA | SCL | COLOR | GND | RX2 | TX2 | 27 | 25 | 23 | 5V | GND | PS2 | AC2MC | I2C | I2C | I2C | LSA_SERIAL